# Altium schematic sheet 07 USB.SchDoc
size 420 x 297 mm
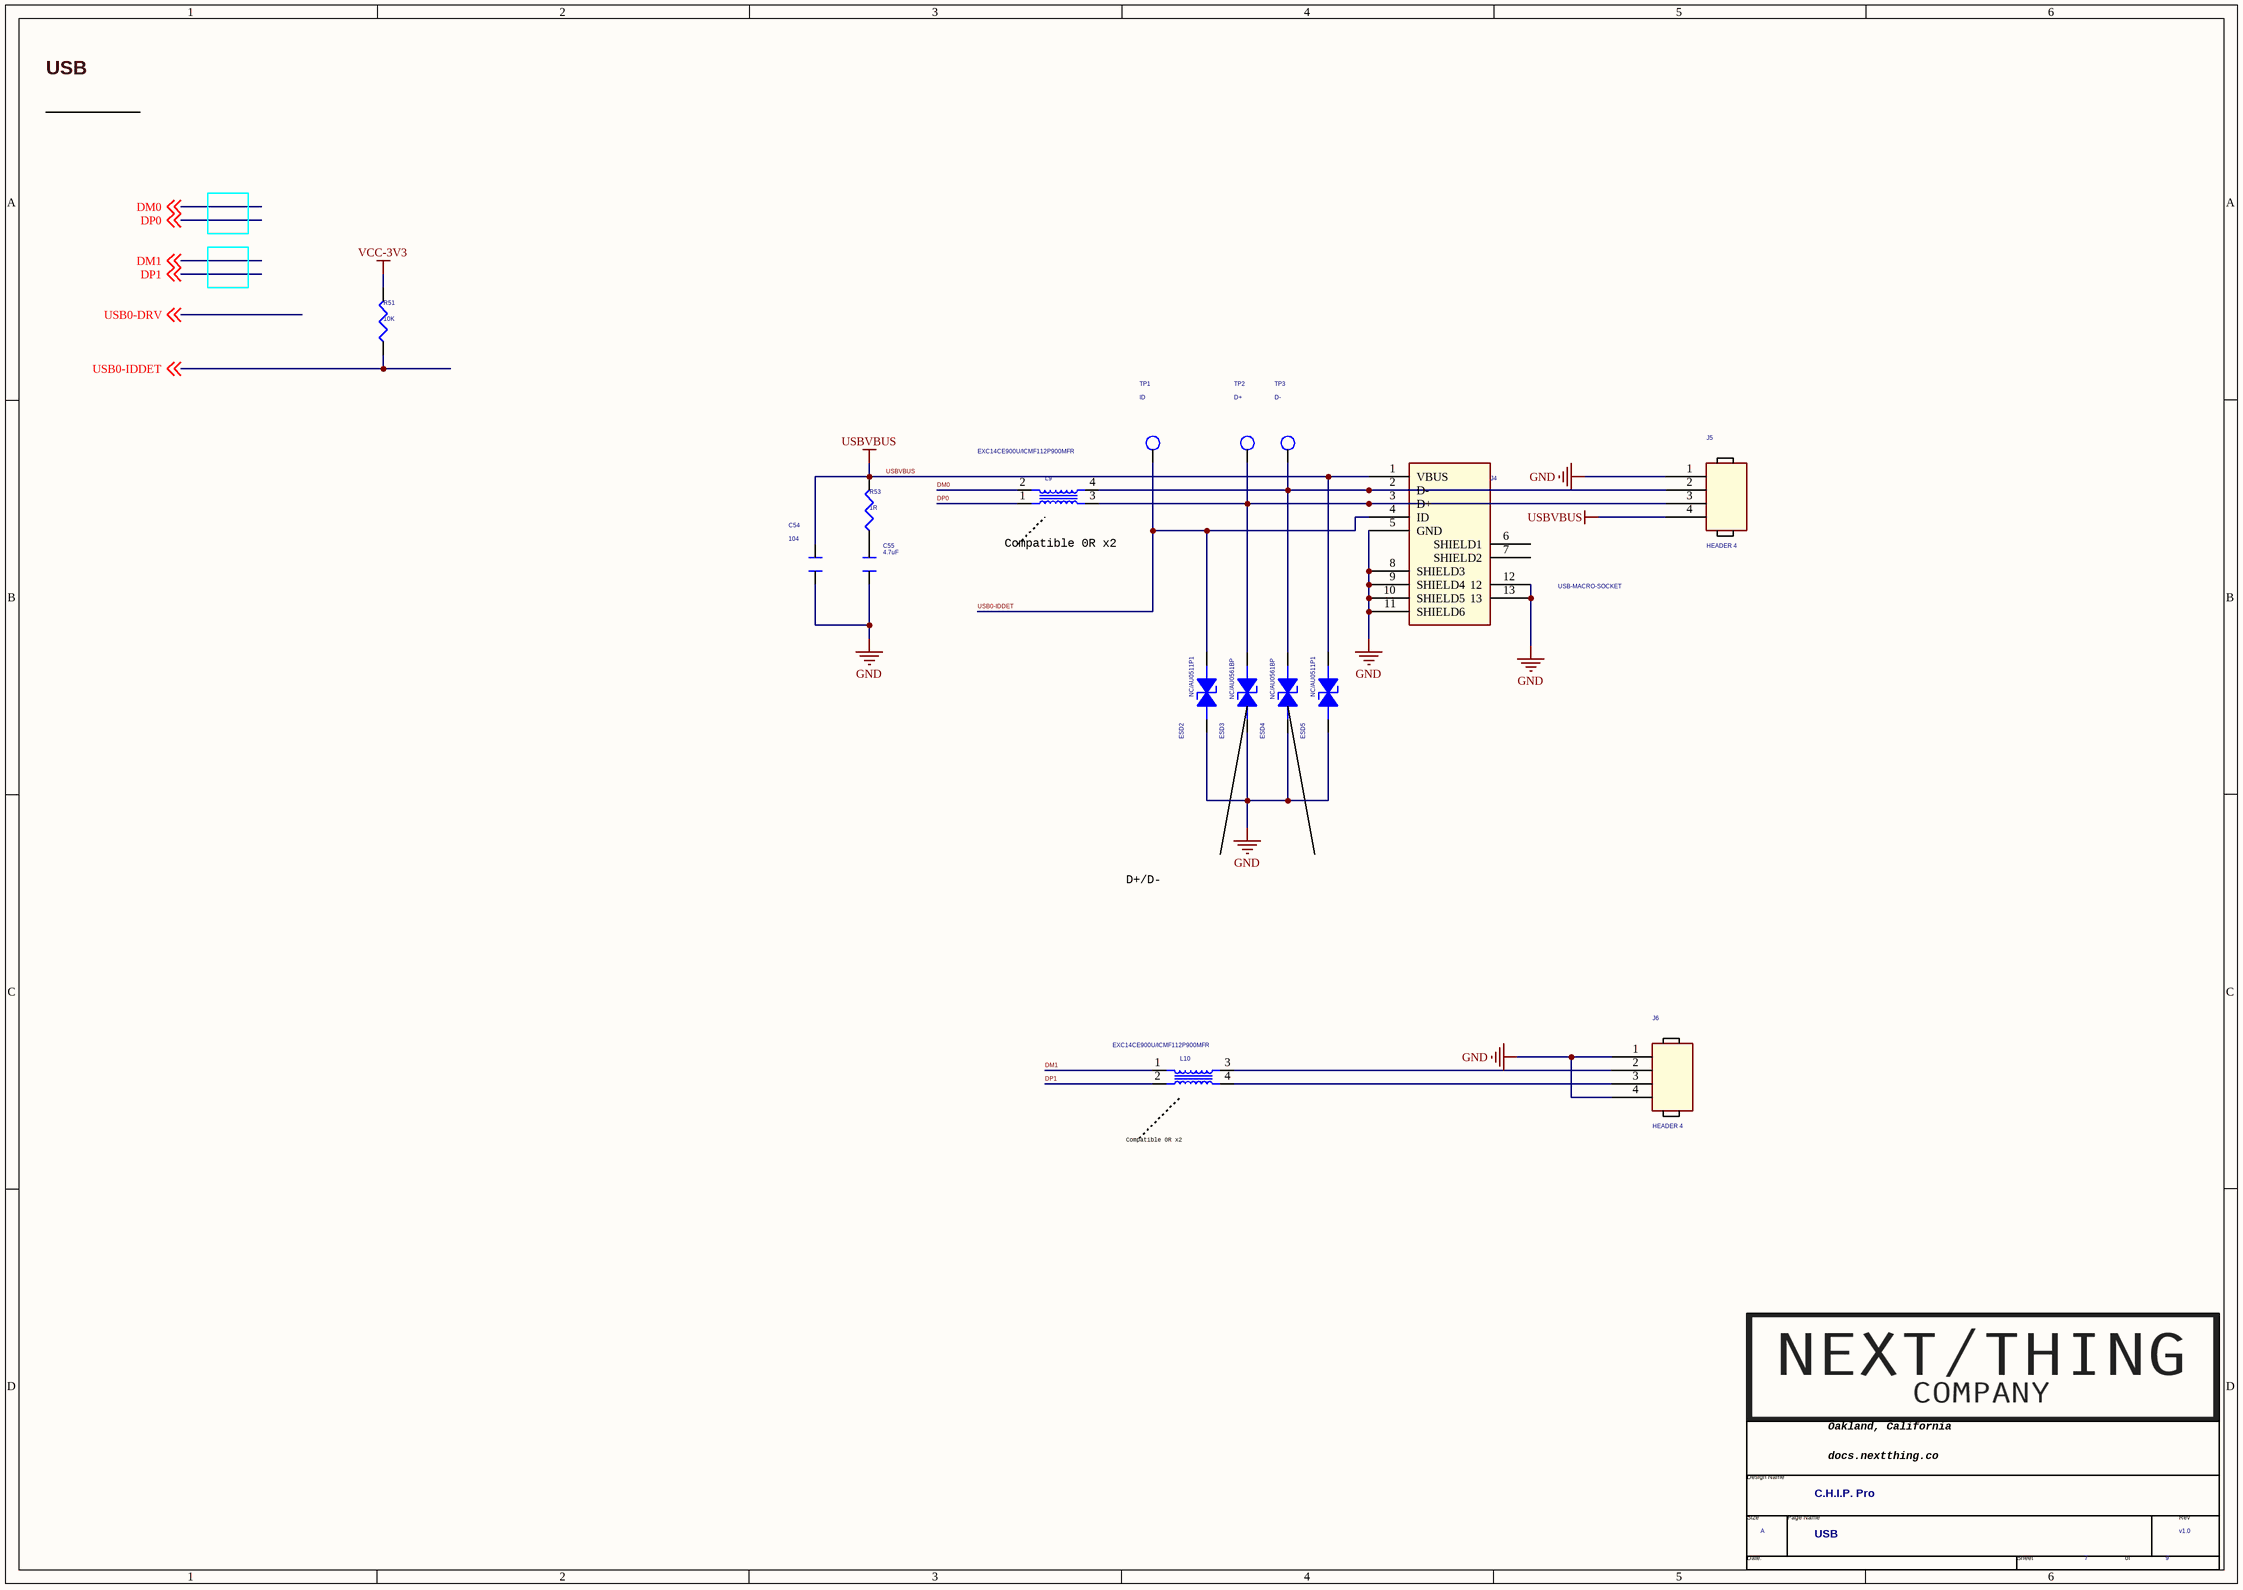
[diagram p0: 07 USB.SchDoc]

## Parts
*  Page Count: 9  Page Number: 7  Page Size: A  Title: C.H.I.P. Pro  RevCode: v1.0  Doc: USB  (hidden comment: TitleBlock1-nextthing)  (graphical)
C54  104  [C0201]
C55  4.7uF  [C0603]
ESD2  NC/AU0511P1  [ESD0402]
ESD3  NC/AU0561BP  [ESD0402]
ESD4  NC/AU0561BP  [ESD0402]
ESD5  NC/AU0511P1  [ESD0402]
J4  USB-MACRO-SOCKET  [USB_MINI_AB]
J5  HEADER 4  [stampvia4]
J6  HEADER 4  [stampvia4]
L9  EXC14CE900U/ICMF112P900MFR  [L0805x2]
L10  EXC14CE900U/ICMF112P900MFR  [L0805x2]
R51  10K  [R0201]
R53  1R  [R0402]
TP1  ID  [tp40_smd]
TP2  D+  [tp40_smd]
TP3  D-  [tp40_smd]

## Nets
GND: C54.1 C55.1 ESD2.2(CATHODE) ESD3.2(CATHODE) ESD4.2(CATHODE) ESD5.2(CATHODE) J4.5(GND) J4.8(SHIELD3) J4.9(SHIELD4) J4.10(SHIELD5) J4.11(SHIELD6) J4.12 J4.13 J5.1 J6.1 J6.4
USBVBUS: C54.2 ESD5.1(ANODE) J4.1(VBUS) J5.4 R53.2
VCC-3V3: R51.2
DM0: L9.2(R2) ; off-sheet DM0
DM1: L10.1(R1) ; off-sheet DM1
DP0: L9.1(R1) ; off-sheet DP0
DP1: L10.2(R2) ; off-sheet DP1
USB0-IDDET: ESD2.1(ANODE) J4.4(ID) R51.1 TP1.1(TP) ; off-sheet USB0-IDDET
NetC55_2: C55.2 R53.1
NetESD3_1: ESD3.1(ANODE) J4.3(D+) J5.3 L9.3(R3) TP2.1(TP)
NetESD4_1: ESD4.1(ANODE) J4.2(D-) J5.2 L9.4(R4) TP3.1(TP)
NetJ6_2: J6.2 L10.3(R3)
NetJ6_3: J6.3 L10.4(R4)

Not connected (* = marked no-connect by the designer): J4 6(SHIELD1) 7(SHIELD2)

## Notes on the sheet
- USB
- (near L9) Compatible 0R x2
- D+/D-
  The parasitic capacitance of esd on D+/D- < 4pf
- Compatible 0R x2
- (in symbol TitleBlock1-nextthing) Oakland, California; Design Name; docs.nextthing.co /; Size; Page Name; Rev; Date:; Sheet; of

## Library data of the parts
C54 = CAPACITOR: Value: 100nF
C55 = CAPACITOR: Value: 4.7uF
ESD2-ESD5 = 1_1.5KE100A: 1ST PART DESCRIPTION: WILL ESD9B5V Bidirection ESD Protection
J4 = USB_MINI_SOCKET_2
L9 L10 = R-PACK4_0
R51 R53 = R_Dup2
TP1-TP3 = T_POINT_R
* = TitleBlock1-nextthing: Page Create Date: March  8, 1995